# Altium schematic sheet LoRa.SchDoc: LoRa MCU
size A4; Engineer: David; DocumentNumber: 5; SheetNumber: 5; SheetTotal: 9; Project: SmartCanton Dev Box; Labo: LSN; PageSetup: Record=PageOptions|CenterHorizontal=True|CenterVertical=True|PrintScale=0.97|XCorrection=1.00|YCorrection=1.00|PrintKind=1|BorderSize=5000000|LeftOffset=0|BottomOffset=0|Orientation=2|PaperLength=1000|PaperWidth=1000|Scale=100|PaperSource=7|PrintQuality=-3|MediaType=1|DitherType=10|PrintScaleMode=1|PaperKind=A4 (210 x 297 mm)|PaperIndex=9
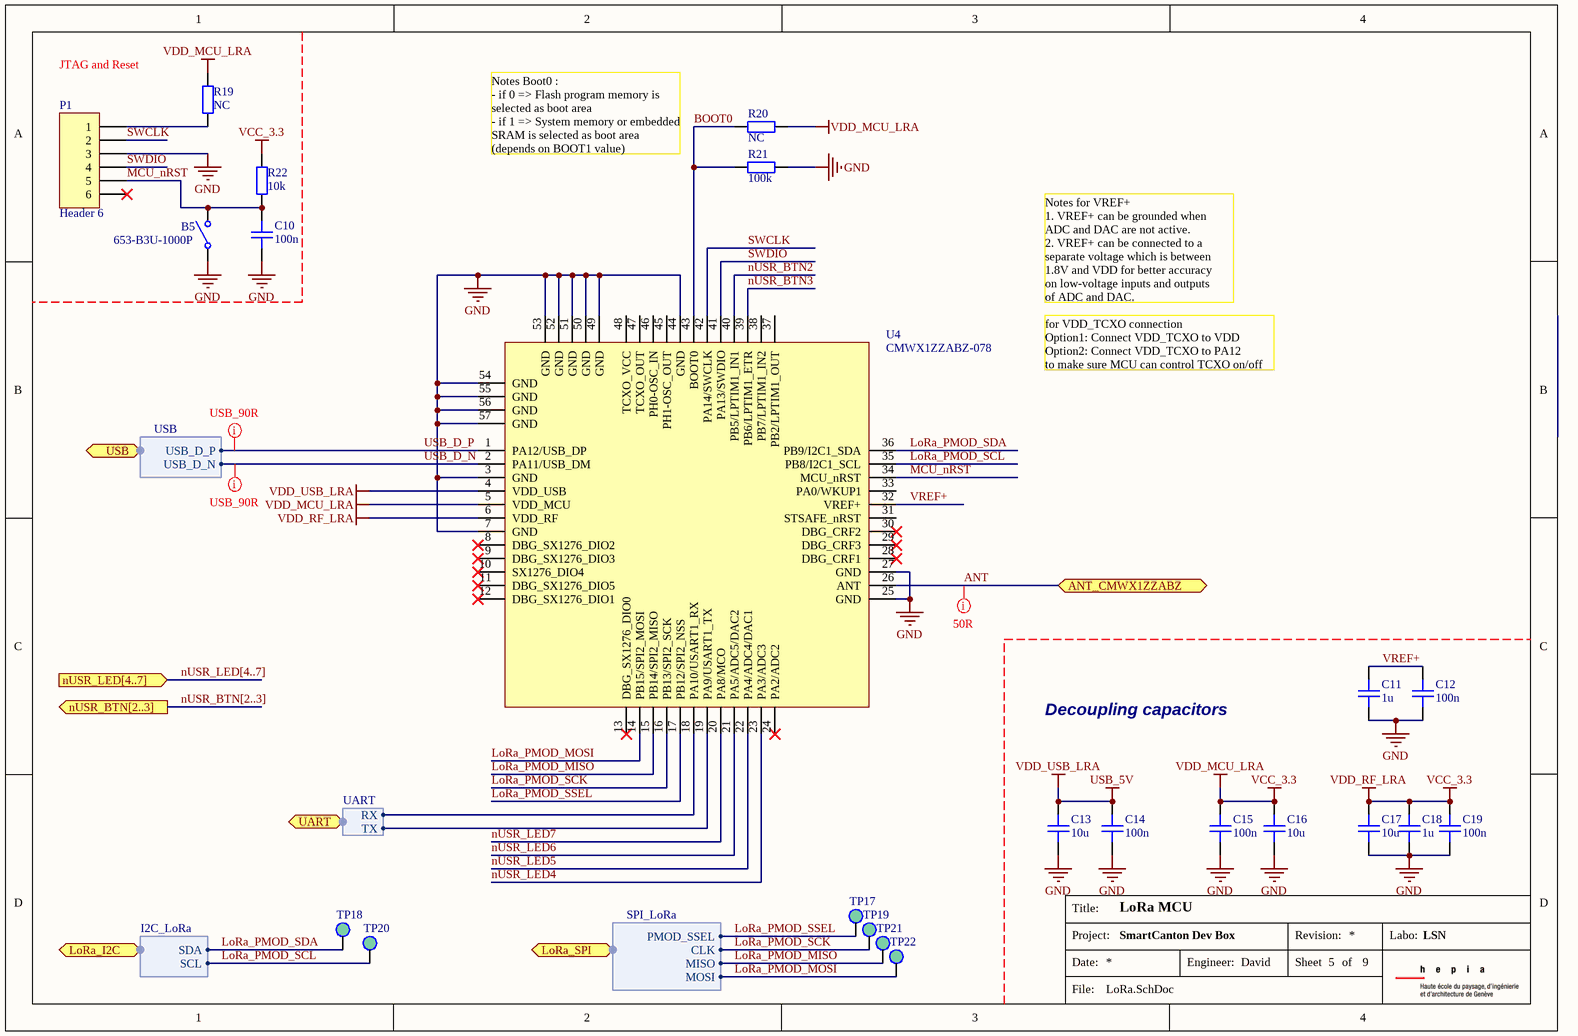
[diagram p0: LoRa.SchDoc]

## Parts
B5  653-B3U-1000P  [B3U-1000P]
C10  100n  [CAPC1608X08]
C11  1u  [CAPC1608X08N]
C12  100n  [CAPC1608X08N]
C13  10u  [CAPC1608X08N]
C14  100n  [CAPC1608X08N]
C15  100n  [CAPC1608X08N]
C16  10u  [CAPC1608X08N]
C17  10u  [CAPC1608X08N]
C18  1u  [CAPC1608X08N]
C19  100n  [CAPC1608X08N]
P1  Header 6  [HDR1X6]
R19  NC  [RESC1608X06]
R20  NC  [RESC1608X06]
R21  100k  [RESC1608X06]
R22  10k  [RESC1608X06]
TP17  5015  [5015]  (value not drawn)
TP18  5015  [5015]  (value not drawn)
TP19  5015  [5015]  (value not drawn)
TP20  5015  [5015]  (value not drawn)
TP21  5015  [5015]  (value not drawn)
TP22  5015  [5015]  (value not drawn)
U4  CMWX1ZZABZ-078  [CMWX1ZZABZ-078]

## Ports
ANT_CMWX1ZZABZ, LoRa_I2C (harness I2C_LoRa), LoRa_SPI (harness SPI_LoRa), nUSR_BTN[2..3] (out), nUSR_LED[4..7] (in), UART (harness UART), USB (harness USB)

## Harnesses
UART: RX, TX
SPI_LoRa: PMOD_SSEL, CLK, MISO, MOSI
I2C_LoRa: SDA, SCL
USB: USB_D_P, USB_D_N

## Nets
GND: B5.1 C10.1 C11.1 C12.1 C13.1 C14.1 C15.1 C16.1 C17.1 C18.1 C19.1 P1.3 R21.2 U4.3(GND) U4.7(GND) U4.25(GND) U4.27(GND) U4.44(GND) U4.49(GND) U4.50(GND) U4.51(GND) U4.52(GND) U4.53(GND) U4.54(GND) U4.55(GND) U4.56(GND) U4.57(GND)
USB_5V: C13.2 C14.2 U4.4(VDD_USB)  [also labelled VDD_USB_LRA]
VCC_3.3: C15.2 C16.2 C17.2 C18.2 C19.2 R19.1 R20.2 R22.1 U4.5(VDD_MCU) U4.6(VDD_RF)  [also labelled VDD_MCU_LRA, VDD_RF_LRA]
ANT: U4.26(ANT) ; port ANT_CMWX1ZZABZ
BOOT0: R20.1 R21.1 U4.43(BOOT0)
LoRa_PMOD_MISO: TP21.1(TP) U4.15(PB14/SPI2_MISO) ; port LoRa_SPI.MISO
LoRa_PMOD_MOSI: TP22.1(TP) U4.14(PB15/SPI2_MOSI) ; port LoRa_SPI.MOSI
LoRa_PMOD_SCK: TP19.1(TP) U4.16(PB13/SPI2_SCK) ; port LoRa_SPI.CLK
LoRa_PMOD_SCL: TP20.1(TP) U4.35(PB8/I2C1_SCL) ; port LoRa_I2C.SCL
LoRa_PMOD_SDA: TP18.1(TP) U4.36(PB9/I2C1_SDA) ; port LoRa_I2C.SDA
LoRa_PMOD_SSEL: TP17.1(TP) U4.17(PB12/SPI2_NSS) ; port LoRa_SPI.PMOD_SSEL
MCU_nRST: B5.2 C10.2 P1.5 R22.2 U4.34(MCU_nRST)
nUSR_BTN2: U4.40(PB5/LPTIM1_IN1)
nUSR_BTN3: U4.39(PB6/LPTIM1_ETR)
nUSR_LED4: U4.23(PA3/ADC3)
nUSR_LED5: U4.22(PA4/ADC4/DAC1)
nUSR_LED6: U4.21(PA5/ADC5/DAC2)
nUSR_LED7: U4.20(PA8/MCO)
SWCLK: P1.2 U4.42(PA14/SWCLK)
SWDIO: P1.4 U4.41(PA13/SWDIO)
USB_D_N: U4.2(PA11/USB_DM) ; port USB.USB_D_N
USB_D_P: U4.1(PA12/USB_DP) ; port USB.USB_D_P
VREF+: C11.2 C12.2 U4.32(VREF+)
NetP1_1: P1.1 R19.2
NetU4_18: U4.18(PA10/USART1_RX) ; port UART.RX
NetU4_19: U4.19(PA9/USART1_TX) ; port UART.TX

Not connected (* = marked no-connect by the designer): P1 6*; U4 8(DBG_SX1276_DIO2)* 9(DBG_SX1276_DIO3)* 10(SX1276_DIO4)* 11(DBG_SX1276_DIO5)* 12(DBG_SX1276_DIO1)* 13(DBG_SX1276_DIO0)* 24(PA2/ADC2)* 28(DBG_CRF1)* 29(DBG_CRF3)* 30(DBG_CRF2)* 31(STSAFE_nRST) 33(PA0/WKUP1) 37(PB2/LPTIM1_OUT) 38(PB7/LPTIM1_IN2) 45(PH1-OSC_OUT) 46(PH0-OSC_IN) 47(TCXO_OUT) 48(TCXO_VCC)

## Buses and harness runs
bus nUSR_BTN[2..3] = port nUSR_BTN[2..3]
bus nUSR_LED[4..7] = port nUSR_LED[4..7]

## Layout directives
rule Impedance Constraint [Min = 49.50    Max = 50.50    ]; net class 50R: ANT
rule Impedance Constraint [Min = 90.00    Max = 90.00    ]; net class USB_90R: USB_D_N, USB_D_P

## Notes on the sheet
- JTAG and Reset
- Notes Boot0 :
  - if 0 => Flash program memory is selected as boot area
  - if 1 => System memory or embedded SRAM is selected as boot area (depends on BOOT1 value)
- Notes for VREF+
  1. VREF+ can be grounded when
  ADC and DAC are not active.
  2. VREF+ can be connected to a
  separate voltage which is between
  1.8V and VDD for better accuracy
  on low-voltage inputs and outputs
  of ADC and DAC.
- for VDD_TCXO connection
  Option1: Connect VDD_TCXO to VDD
  Option2: Connect VDD_TCXO to PA12
  to make sure MCU can control TCXO on/off
- Decoupling capacitors
- Title:
- Date:
- Project:
- Engineer:
- Revision:
- Sheet
- of
- Labo:
- File:

## Library data of the parts
B5 = PUSH_BUTTON: Supplier 1: Mouser; Supplier Part Number 1: 653-B3U-1000P
C10 = CMP-001-0010-A.3: MLCC Capacitor 1608; AccessRights: 2147483647; ContentType: Component; Folder: LSN\Components\Passifs\Condensateurs\; RevisionId: A.2; Value: 100n; ComponentType: Capacitor; ContentTypeGUID: CB3C11C4-E317-11DF-B822-12313F0024A2; FolderGUID: 9DA6C5B0-B134-4C0D-99DA-A840DED25FBD; ItemGUID: 6B05C9AF-D3C2-4723-98C2-0E51694C471A; ItemHRID: CMP-001-0010; LifeCycle: New From Design; LifeCycleStateGUID: 706004B5-C76E-482E-903B-BA0E4FAE086A; ReleaseDate: 31/10/2016 02:21:03 PM
C11-C19 = CMP-001-0010-A.1: MLCC Capacitor 1608
  C11 C18: Value: 1u
  C12 C14 C15 C19: Value: 100n
  C13 C16 C17: Value: 10u
P1 = Header 6: Header, 6-Pin; LatestRevisionDate: 17-Jul-2002; LatestRevisionNote: Re-released for DXP Platform.; Publisher: Altium Limited
R19-R22 = CMP-001-0005-A.4: 1608 resistor
  R19 R20: Value: NC
  R21: Value: 100k
  R22: Value: 10k
TP17-TP22 = CMP-001-0108-A.3: Circuit Board Hardware - PCB MINI SMT TEST POINT
U4 = CMP-001-0102-A.1: RF Modules Type ABZ LoRa Module MCU - STM32L082; Supplier 1: Mouser; Supplier Part Number 1: 81-CMWX1ZZABZ-078